# EasyEDA schematic SCH_handcryption_2026-06-17.json
TITLE: Handcryption Wiring Diagram; REV: 1.0; Date: 2026-06-08; Sheet: 1/1; Drawn By: joethecreator; Company: Gadget Studios
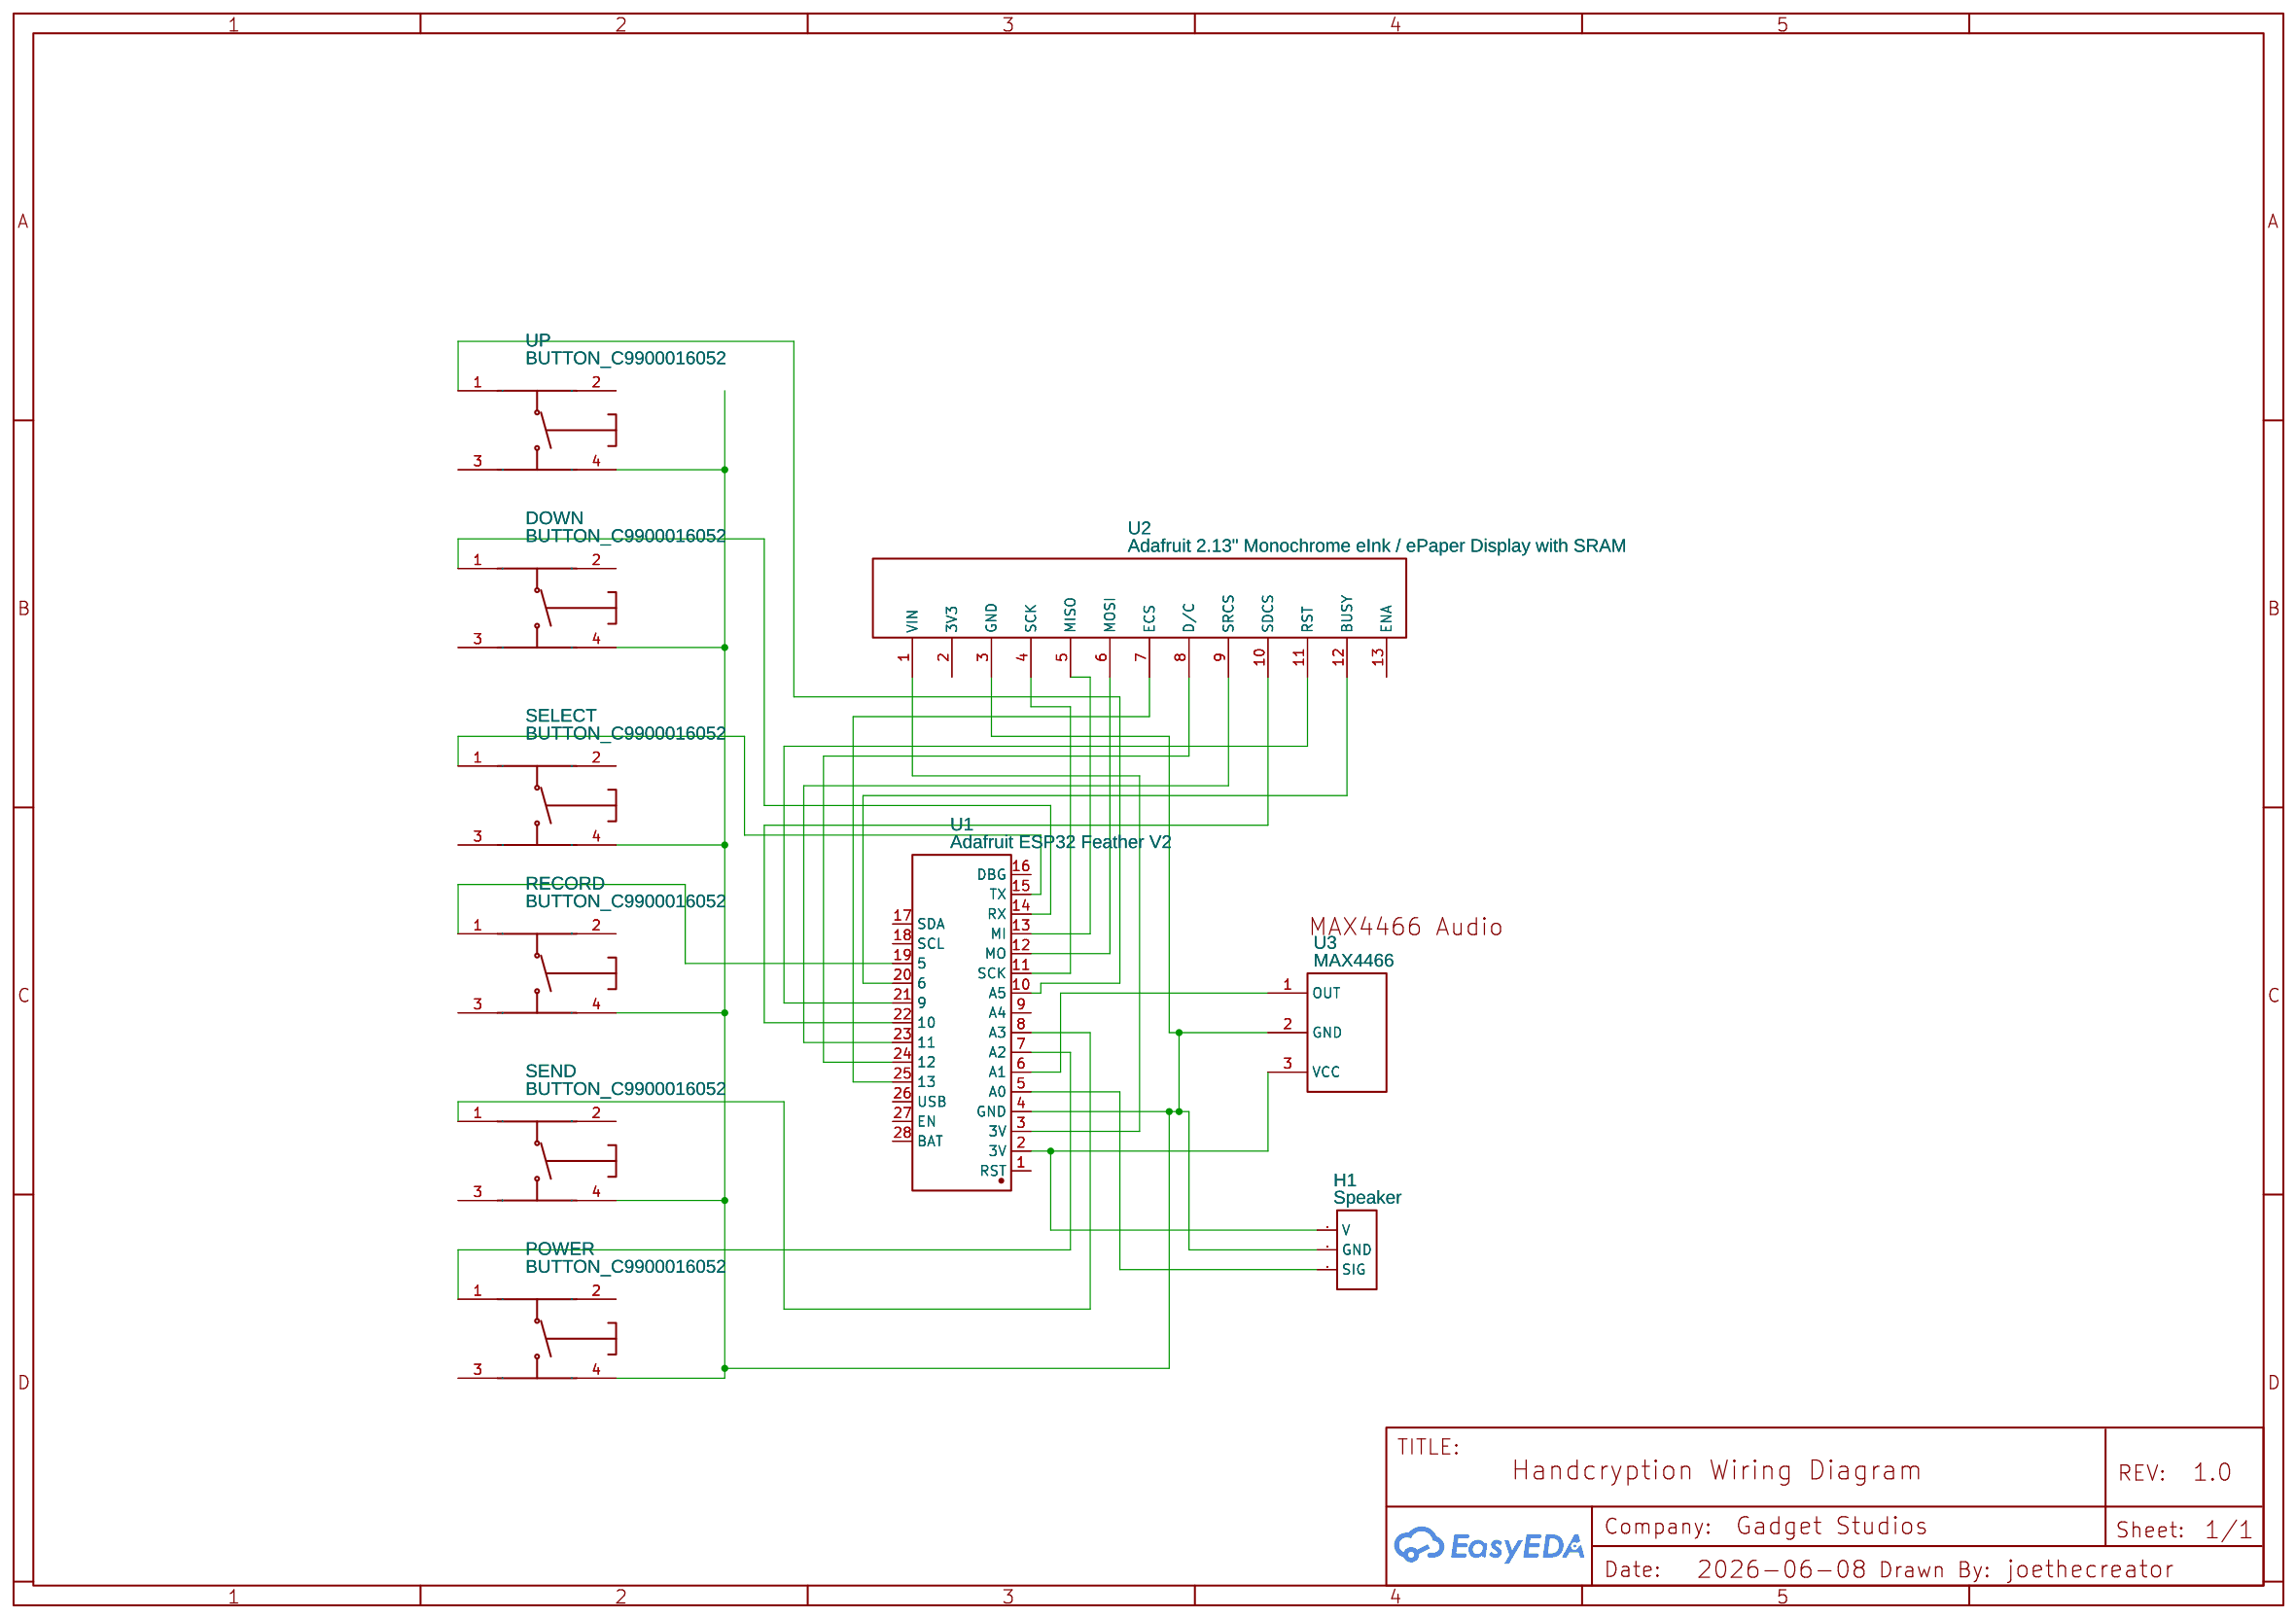
[diagram p0: schematic sheet]

## Parts
DOWN  BUTTON_C9900016052  [SW-SMD_4P-L5.1-W5.1-P3.70-LS6.5-TL-2]
H1  Speaker  [HDR-F-2.54_1X3]
POWER  BUTTON_C9900016052  [SW-SMD_4P-L5.1-W5.1-P3.70-LS6.5-TL-2]
RECORD  BUTTON_C9900016052  [SW-SMD_4P-L5.1-W5.1-P3.70-LS6.5-TL-2]
SELECT  BUTTON_C9900016052  [SW-SMD_4P-L5.1-W5.1-P3.70-LS6.5-TL-2]
SEND  BUTTON_C9900016052  [SW-SMD_4P-L5.1-W5.1-P3.70-LS6.5-TL-2]
U1  Adafruit ESP32 Feather V2  [ADAFRUIT ESP32 FEATHER V2]
U2  Adafruit 2.13" Monochrome eInk / ePaper Display with SRAM
U3  MAX4466  [MAX4466 AUDIO SENSOR]
UP  BUTTON_C9900016052  [SW-SMD_4P-L5.1-W5.1-P3.70-LS6.5-TL-2]

## Library data of the parts
DOWN POWER RECORD SELECT SEND UP = BUTTON_C9900016052: Contributor: lcsc; Supplier: LCSC; Supplier Part: C9900016052; Manufacturer: null; Manufacturer Part: button; JLCPCB Part Class: Extended Part
H1 = HDR-F-2.54_1x3: Supplier Part: C146690; Supplier: LCSC; Contributor: LCEDA_Lib
U1 = Adafruit ESP32 Feather V2: Manufacturer: Adafruit Industries; Manufacturer Part: 5483; Supplier: LCSC; Supplier Part: C17419865; Contributor: lenstruttmann
U2 = Adafruit 2.13" Monochrome eInk / ePaper Display with SRAM: Contributor: Patryk Akhurst
U3 = MAX4466: Manufacturer: Adafruit Industries; Supplier: Adafruit Industries; link: https://www.adafruit.com/product/1063; Contributor: Stuka15

## Nets
Net-(DOWN-1): DOWN.1 U1.14(RX)
Net-(DOWN-4): DOWN.4 H1.2(GND) POWER.4 RECORD.4 SELECT.4 SEND.4 U1.4(GND) U2.3(GND) U3.2(GND) UP.4
Net-(H1-1): H1.1(V) U1.2(3V) U3.3(VCC)
Net-(H1-3): H1.3(SIG) U1.5(A0)
Net-(POWER-1): POWER.1 U1.7(A2)
Net-(RECORD-1): RECORD.1 U1.19(5)
Net-(SELECT-1): SELECT.1 U1.15(TX)
Net-(SEND-1): SEND.1 U1.8(A3)
Net-(U1-3): U1.3(3V) U2.1(VIN)
Net-(U1-6): U1.6(A1) U3.1(OUT)
Net-(U1-10): U1.10(A5) UP.1
Net-(U1-11): U1.11(SCK) U2.4(SCK)
Net-(U1-12): U1.12(MO) U2.6(MOSI)
Net-(U1-13): U1.13(MI) U2.5(MISO)
Net-(U1-20): U1.20(6) U2.12(BUSY)
Net-(U1-21): U1.21(9) U2.11(RST)
Net-(U1-22): U1.22(10) U2.10(SDCS)
Net-(U1-23): U1.23(11) U2.9(SRCS)
Net-(U1-24): U1.24(12) U2.8(D/C)
Net-(U1-25): U1.25(13) U2.7(ECS)

Not connected (* = marked no-connect by the designer): DOWN 2 3; POWER 2 3; RECORD 2 3; SELECT 2 3; SEND 2 3; U1 1(RST) 9(A4) 16(DBG) 17(SDA) 18(SCL) 26(USB) 27(EN) 28(BAT); U2 2(3V3) 13(ENA); UP 2 3
